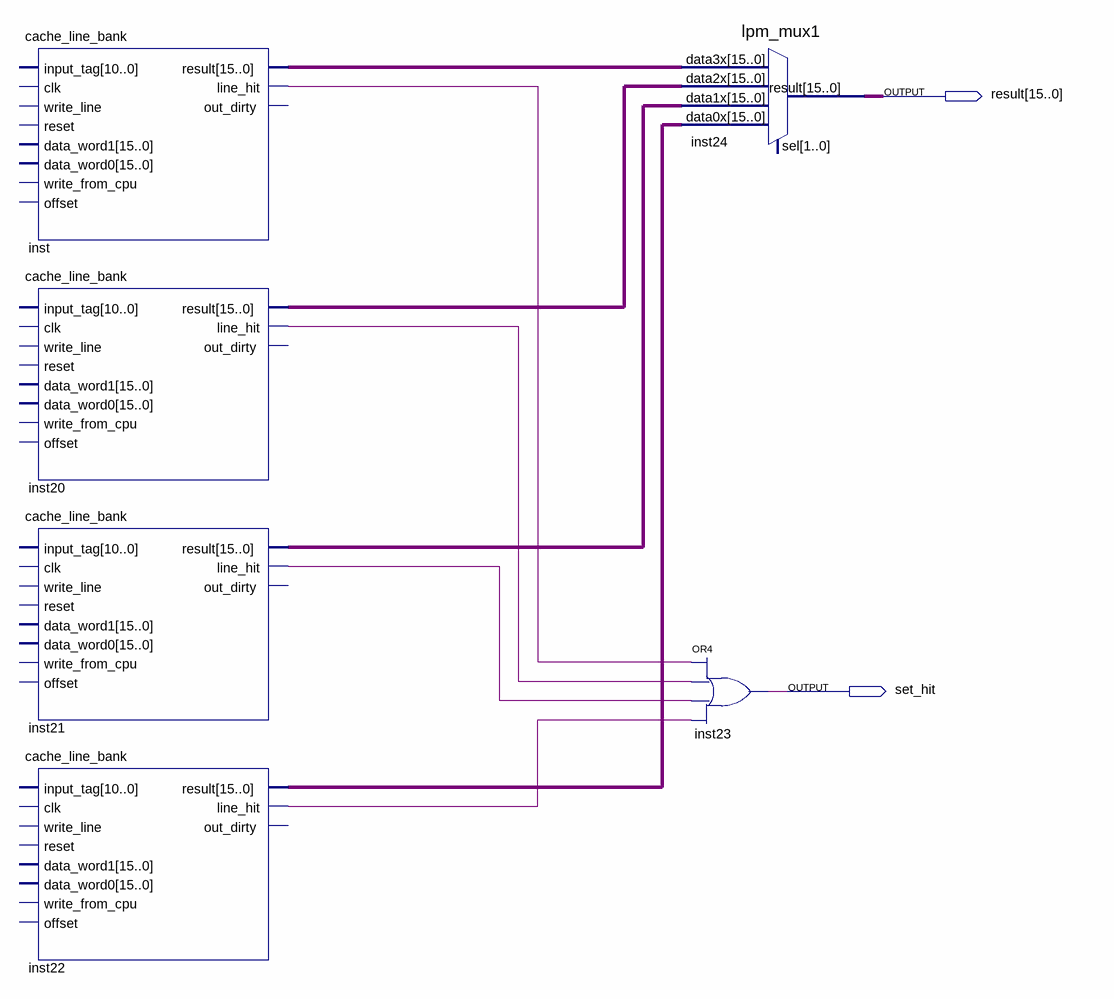
[diagram p0: schematic sheet]
// Quartus schematic cache_set_4_way_controller.bdf as structural Verilog: 6 symbols, 2 pins
module cache_set_4_way_controller (
  output [15:0] result,
  output set_hit
);

  wire inst20_line_hit, inst21_line_hit, inst22_line_hit, inst_line_hit;
  wire [15:0] inst20_result, inst21_result, inst22_result, inst_result;

  cache_line_bank inst (
    .result(inst_result), .line_hit(inst_line_hit));  // open: input_tag, clk, write_line, reset, data_word1, data_word0, write_from_cpu, offset, out_dirty
  cache_line_bank inst20 (
    .result(inst20_result), .line_hit(inst20_line_hit));  // open: input_tag, clk, write_line, reset, data_word1, data_word0, write_from_cpu, offset, out_dirty
  cache_line_bank inst21 (
    .result(inst21_result), .line_hit(inst21_line_hit));  // open: input_tag, clk, write_line, reset, data_word1, data_word0, write_from_cpu, offset, out_dirty
  cache_line_bank inst22 (
    .result(inst22_result), .line_hit(inst22_line_hit));  // open: input_tag, clk, write_line, reset, data_word1, data_word0, write_from_cpu, offset, out_dirty
  lpm_mux1 inst24 (
    .data3x(inst_result), .data2x(inst20_result), .data1x(inst21_result), .data0x(inst22_result),
    .result(result));  // open: sel
  or inst23 (set_hit, inst_line_hit, inst20_line_hit, inst21_line_hit, inst22_line_hit);
endmodule
